# EAGLE schematic AD9850 Board (EAGLE 6.6.0)
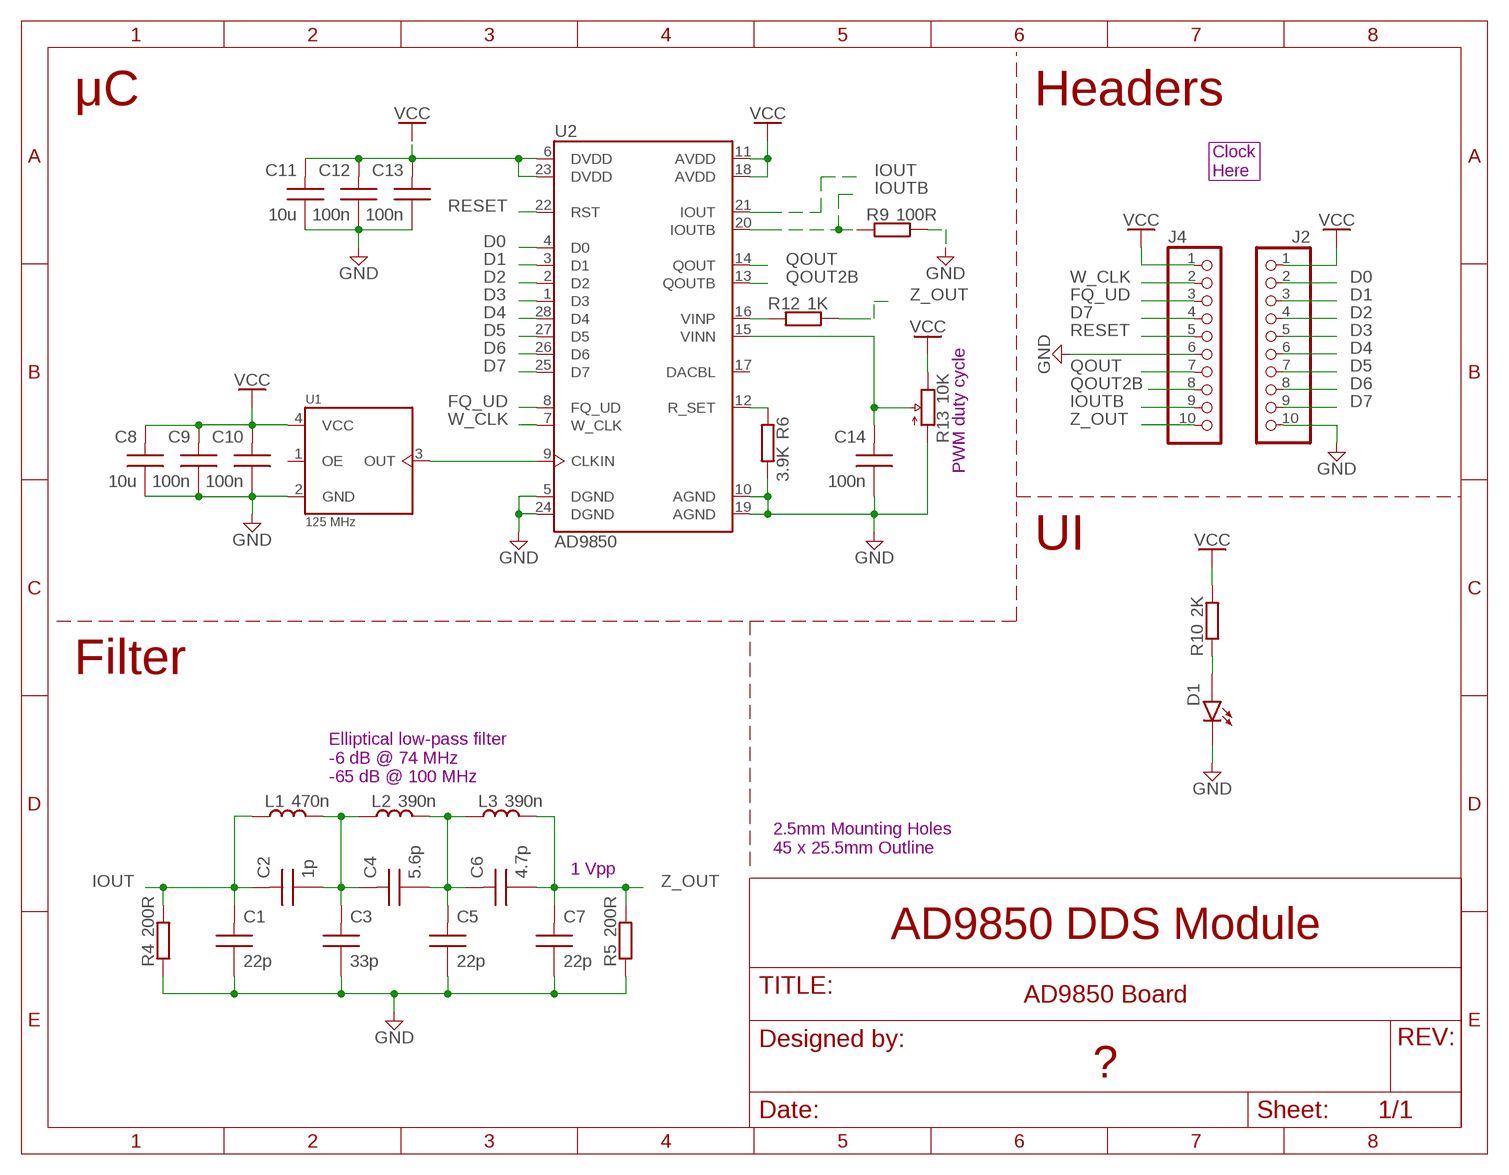
[diagram p0: schematic, sheet 1]

## Parts
C1  22p  CAPACITOR_0805  [SMT-0805]
C2  1p  CAPACITOR_0805  [SMT-0805]
C3  33p  CAPACITOR_0805  [SMT-0805]
C4  5.6p  CAPACITOR_0805  [SMT-0805]
C5  22p  CAPACITOR_0805  [SMT-0805]
C6  4.7p  CAPACITOR_0805  [SMT-0805]
C7  22p  CAPACITOR_0805  [SMT-0805]
C8  10u  CAPACITOR_0805  [SMT-0805]
C9  100n  CAPACITOR_0805  [SMT-0805]
C10  100n  CAPACITOR_0805  [SMT-0805]
C11  10u  CAPACITOR_0805  [SMT-0805]
C12  100n  CAPACITOR_0805  [SMT-0805]
C13  100n  CAPACITOR_0805  [SMT-0805]
C14  100n  CAPACITOR_0805  [SMT-0805]
D1  LED_0805  [SMT-0805-LED]
J2  HEADER-1X10  [1X10]
J4  HEADER-1X10  [1X10]
L1  470n  INDUCTOR  [SMT-0805]
L2  390n  INDUCTOR  [SMT-0805]
L3  390n  INDUCTOR  [SMT-0805]
R4  200R  RESISTOR_SMT-0805  [SMT-0805]
R5  200R  RESISTOR_SMT-0805  [SMT-0805]
R6  3.9K  RESISTOR_SMT-0805  [SMT-0805]
R9  100R  RESISTOR_SMT-0805  [SMT-0805]
R10  2K  RESISTOR_SMT-0805  [SMT-0805]
R12  1K  RESISTOR_SMT-0805  [SMT-0805]
R13  10K  RESISTOR-VAR  [TH-100MIL-RESISTOR-VAR]
U1  125 MHz  CLOCK  [PLACEHOLDER4]
U2  AD9850  [TSSOP28-0.65MM]

## Nets
D0: J2.2 U2.4(D0)
D1: J2.3 U2.3(D1)
D2: J2.4 U2.2(D2)
D3: J2.5 U2.1(D3)
D4: J2.6 U2.28(D4)
D5: J2.7 U2.27(D5)
D6: J2.8 U2.26(D6)
D7: J2.9 J4.4 U2.25(D7)
FQ_UD: J4.3 U2.8(FQ_UD)
GND: C1.P$2 C3.P$2 C5.P$2 C7.P$2 C8.P$2 C9.P$2 C10.P$2 C11.P$2 C12.P$2 C13.P$2 C14.P$2 D1.C(CATHODE) J2.10 J4.6 R4.P$1 R5.P$1 R6.P$2 R9.P$2 R13.CCW U1.2(GND) U2.5(DGND) U2.10(AGND) U2.19(AGND) U2.24(DGND)
IOUT: C1.P$1 C2.P$1 L1.P$1 R4.P$2 U2.21(IOUT)
IOUTB: J4.9 R9.P$1 U2.20(IOUTB)
N$1: U1.3(OUT) U2.9(CLKIN)
N$3: R12.P$1 U2.16(VINP)
N$4: R6.P$1 U2.12(R_SET)
N$5: C2.P$2 C3.P$1 C4.P$1 L1.P$2 L2.P$1
N$6: C14.P$1 R13.WIPER U2.15(VINN)
N$7: C4.P$2 C5.P$1 C6.P$1 L2.P$2 L3.P$1
N$10: D1.A(ANODE) R10.P$1
QOUT: J4.7 U2.14(QOUT)
QOUT2B: J4.8 U2.13(QOUTB)
RESET: J4.5 U2.22(RST)
V+: C8.P$1 C9.P$1 C10.P$1 C11.P$1 C12.P$1 C13.P$1 J2.1 J4.1 R10.P$2 R13.CW U1.4(VCC) U2.6(DVDD) U2.11(AVDD) U2.18(AVDD) U2.23(DVDD) ; supply symbol labelled VCC
W_CLK: J4.2 U2.7(W_CLK)
Z_OUT: C6.P$2 C7.P$1 J4.10 L3.P$2 R5.P$2 R12.P$2
Unconnected: U1.1(OE) U2.17(DACBL)

## Notes on the sheet
- μC | Headers
- Clock
  Here
- PWM duty cycle
- UI
- Filter
- Elliptical low-pass filter
  -6 dB @ 74 MHz
  -65 dB @ 100 MHz
- 2.5mm Mounting Holes
  45 x 25.5mm Outline
- 1 Vpp
- AD9850 DDS Module
- ?

## Library data of the parts
C1-C14 = -StdLib-Passives:CAPACITOR
D1 = -StdLib-Passives:LED
J2 J4 = -StdLib-Connectors:HEADER-1X10: PIN HEADER
L1-L3 = -StdLib-Passives:INDUCTOR
R4-R6 R9 R10 R12 = -StdLib-Passives:RESISTOR
R13 = -StdLib-Passives:RESISTOR-VAR
U1 = -StdLib-ICs:CLOCK
U2 = -StdLib-ICs:AD9850